# Altium project SEUJtagCable.PrjPcb
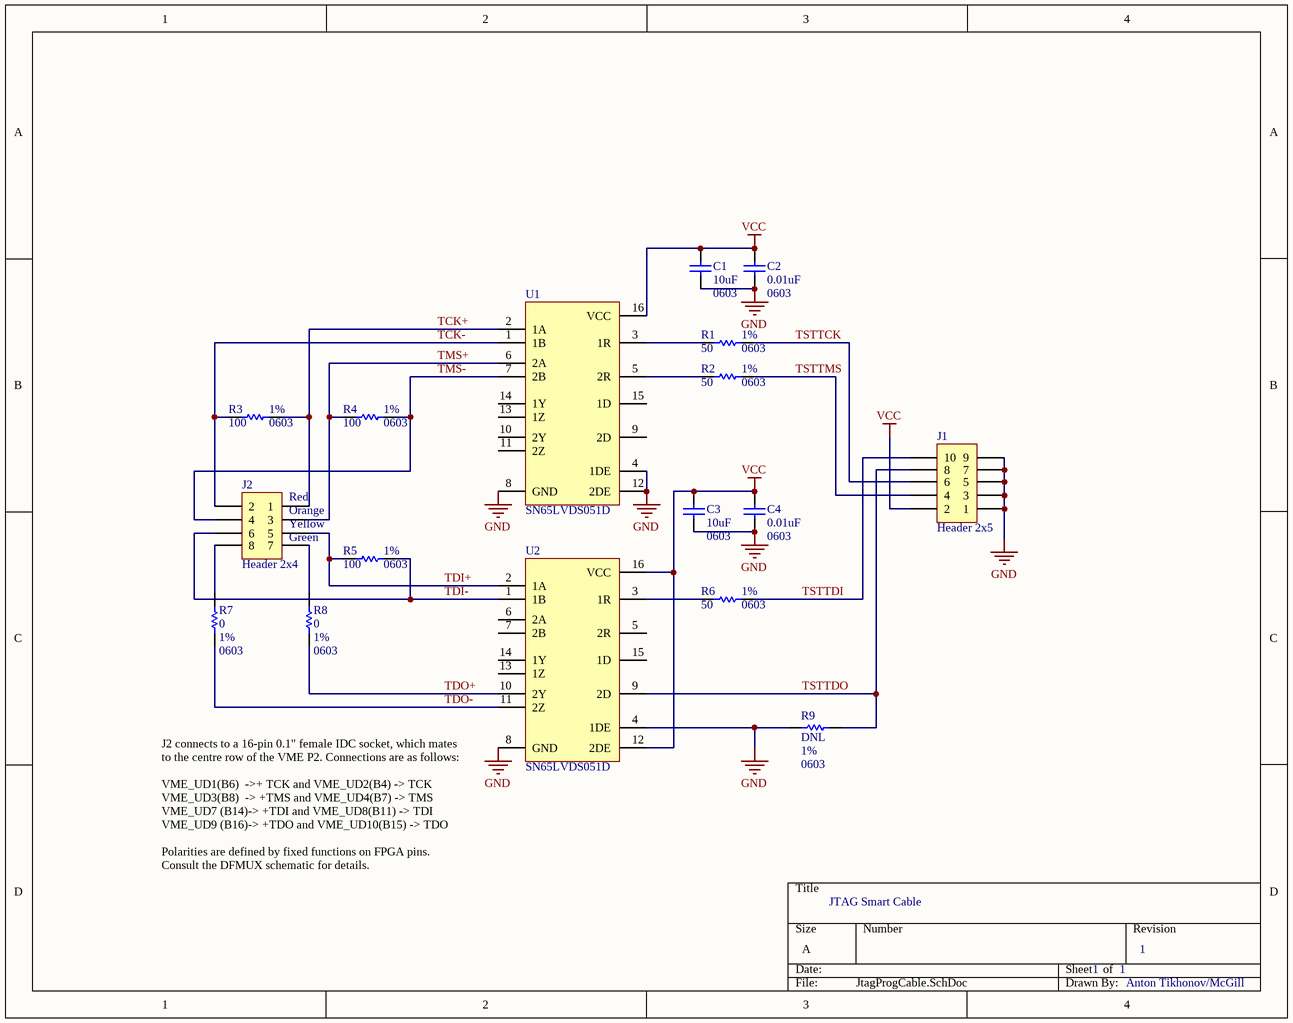
[diagram p0: JtagProgCable.SchDoc]
1 sheet, 17 parts. Net scope: global (net labels, ports and power ports of the same name join across sheets).
Board file: JtagProgCable.PcbDoc

## Sheet JtagProgCable.SchDoc
size A

### Parts
C1  10uF  Footprint: 0603  [CC1608-0603M]
C2  0.01uF  Footprint: 0603  [CC1608-0603M]
C3  10uF  Footprint: 0603  [CC1608-0603M]
C4  0.01uF  Footprint: 0603  [CC1608-0603M]
J1  Header 2x5  [HDR2X5]
J2  Header 2x4  [HDR2X4]
R1  50  Param: 1%  Footprint: 0603  [CR1608-0603M]
R2  50  Param: 1%  Footprint: 0603  [CR1608-0603M]
R3  100  Param: 1%  Footprint: 0603  [CR1608-0603M]
R4  100  Param: 1%  Footprint: 0603  [CR1608-0603M]
R5  100  Param: 1%  Footprint: 0603  [CR1608-0603M]
R6  50  Param: 1%  Footprint: 0603  [CR1608-0603M]
R7  0  Param: 1%  Footprint: 0603  [CR1608-0603M]
R8  0  Param: 1%  Footprint: 0603  [CR1608-0603M]
R9  DNL  Param: 1%  Footprint: 0603  [CR1608-0603M]
U1  SN65LVDS051D  [SO-G16 (SOIC)]
U2  SN65LVDS051D  [SO-G16 (SOIC)]

### Nets
GND: C1.1 C2.1 C3.1 C4.1 J1.1 J1.3 J1.5 J1.7 J1.9 R9.2 U1.4(1DE) U1.8(GND) U1.12(2DE) U2.4(1DE) U2.8(GND)
VCC: C1.2 C2.2 C3.2 C4.2 J1.2 U1.16(VCC) U2.12(2DE) U2.16(VCC)
TCK+: J2.1 R3.2 U1.2(1A)
TCK-: J2.2 R3.1 U1.1(1B)
TDI+: J2.5 R5.1 U2.2(1A)
TDI-: J2.6 R5.2 U2.1(1B)
TDO+: R8.1 U2.10(2Y)
TDO-: R7.1 U2.11(2Z)
TMS+: J2.3 R4.1 U1.6(2A)
TMS-: J2.4 R4.2 U1.7(2B)
TSTTCK: J1.6 R1.2
TSTTDI: J1.10 R6.2
TSTTDO: J1.8 R9.1 U2.9(2D)
TSTTMS: J1.4 R2.2
NetJ2_7: J2.7 R8.2
NetJ2_8: J2.8 R7.2
NetR1_1: R1.1 U1.3(1R)
NetR2_1: R2.1 U1.5(2R)
NetR6_1: R6.1 U2.3(1R)

Not connected (* = marked no-connect by the designer): U1 9(2D) 10(2Y) 11(2Z) 13(1Z) 14(1Y) 15(1D); U2 5(2R) 6(2A) 7(2B) 13(1Z) 14(1Y) 15(1D)

### Notes on the sheet
- (near J2) Red
- (near J2) Orange
- (near J2) Yellow
- (near J2) Green
- J2 connects to a 16-pin 0.1" female IDC socket, which mates to the centre row of the VME P2. Connections are as follows:
  VME_UD1(B6)  ->+ TCK and VME_UD2(B4) -> TCK
  VME_UD3(B8)  -> +TMS and VME_UD4(B7) -> TMS
  VME_UD7 (B14)-> +TDI and VME_UD8(B11) -> TDI
  VME_UD9 (B16)-> +TDO and VME_UD10(B15) -> TDO
  Polarities are defined by fixed functions on FPGA pins. Consult the DFMUX schematic for details.
- JTAG Smart Cable
- 1
- Anton Tikhonov/McGill

### Library data of the parts
C1-C4 = Cap1: Capacitor, Ceramic, 0603; TechInf: *; Param1: *
J1 = Header 2x5: Header, 0.1" 5x2-Pin straight; Assembly: DNL,; Footprint: *; Publisher: *
J2 = Header 2x4: Header, 0.1" 4x2-Pin straight; Assembly: DNL,; Footprint: *; Publisher: *
R1-R9 = Res1: Resistor, 1%, 100ppm, 0603; Param1: 100ppm/C; TechInfo: *
U1 U2 = SN65LVDM051QDQ1: differential line drivers and receivers